# Altium schematic sheet FPGA_IO_3_4_5.SchDoc
size Tabloid; SheetNumber: 7; SheetTotal: 7; Sheet_Name: FPGA IO BANKS 3, 4 & 5; Size: 11x17
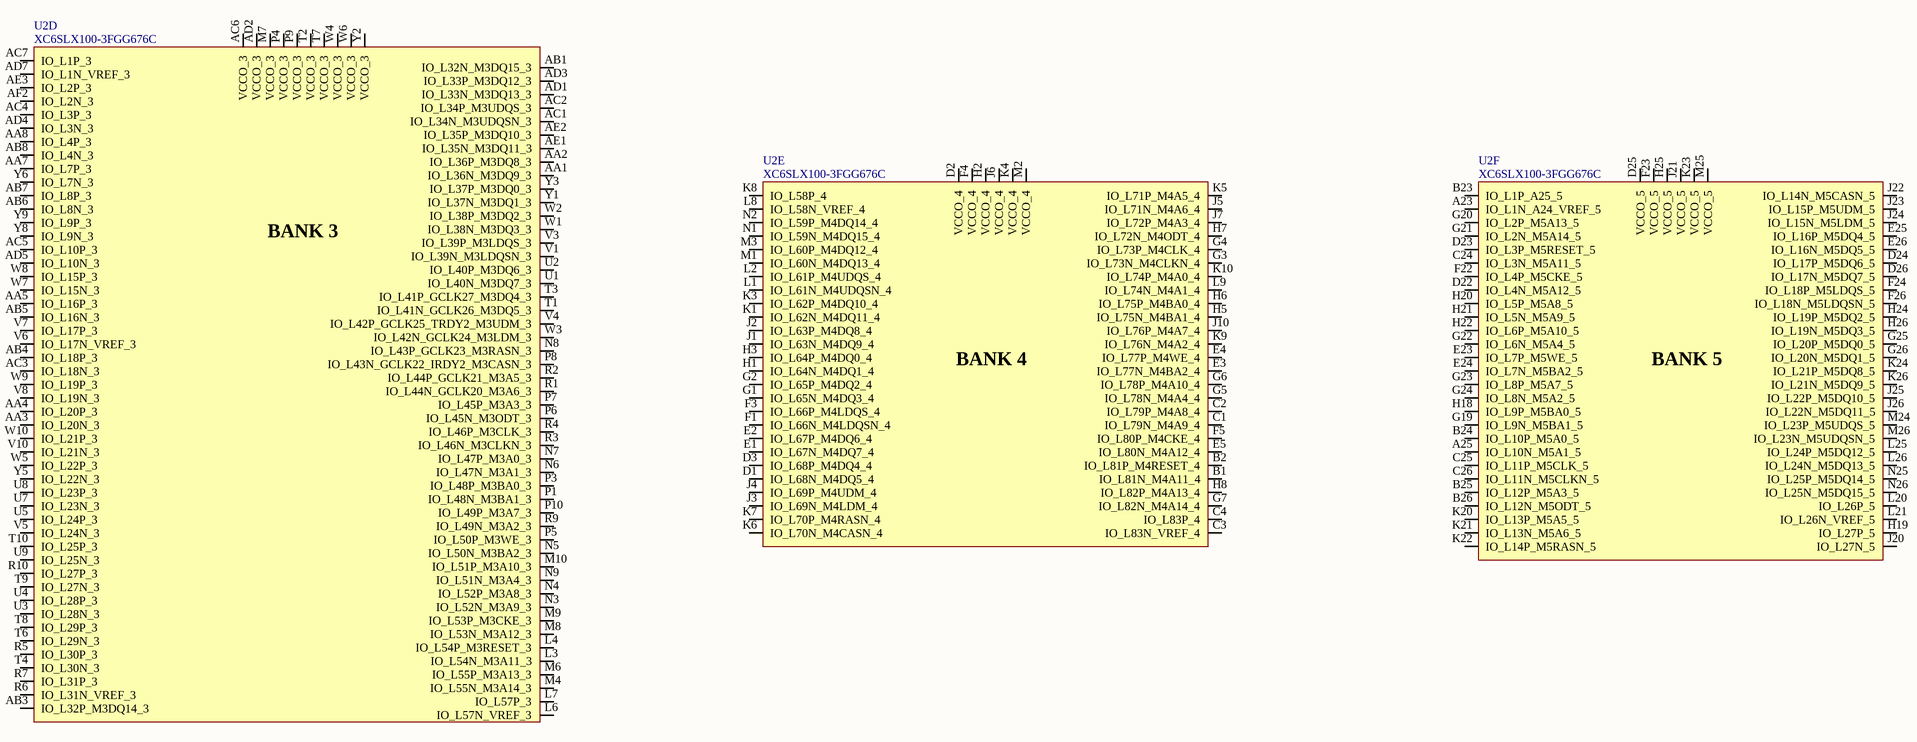
[diagram p0: FPGA_IO_3_4_5.SchDoc]

## Parts
U2  XC6SLX100-3FGG676C  [FPGA_XILINX_FGG676]  (parts D,E,F of 10)

## Nets

Not connected (* = marked no-connect by the designer): U2 A23(IO_L1N_A24_VREF_5) A25(IO_L10N_M5A1_5) AA1(IO_L36N_M3DQ9_3) AA2(IO_L36P_M3DQ8_3) AA3(IO_L20N_3) AA4(IO_L20P_3) AA5(IO_L16P_3) AA7(IO_L7P_3) AA8(IO_L4P_3) AB1(IO_L32N_M3DQ15_3) AB3(IO_L32P_M3DQ14_3) AB4(IO_L18P_3) AB5(IO_L16N_3) AB6(IO_L8N_3) AB7(IO_L8P_3) AB8(IO_L4N_3) AC1(IO_L34N_M3UDQSN_3) AC2(IO_L34P_M3UDQS_3) AC3(IO_L18N_3) AC4(IO_L3P_3) AC5(IO_L10P_3) AC6(VCCO_3) AC7(IO_L1P_3) AD1(IO_L33N_M3DQ13_3) AD2(VCCO_3) AD3(IO_L33P_M3DQ12_3) AD4(IO_L3N_3) AD5(IO_L10N_3) AD7(IO_L1N_VREF_3) AE1(IO_L35N_M3DQ11_3) AE2(IO_L35P_M3DQ10_3) AE3(IO_L2P_3) AF2(IO_L2N_3) B1(IO_L81N_M4A11_4) B2(IO_L81P_M4RESET_4) B23(IO_L1P_A25_5) B24(IO_L10P_M5A0_5) B25(IO_L12P_M5A3_5) B26(IO_L12N_M5ODT_5) C1(IO_L79N_M4A9_4) C2(IO_L79P_M4A8_4) C3(IO_L83N_VREF_4) C4(IO_L83P_4) C24(IO_L3N_M5A11_5) C25(IO_L11P_M5CLK_5) C26(IO_L11N_M5CLKN_5) D1(IO_L68N_M4DQ5_4) D2(VCCO_4) D3(IO_L68P_M4DQ4_4) D22(IO_L4N_M5A12_5) D23(IO_L3P_M5RESET_5) D24(IO_L17P_M5DQ6_5) D25(VCCO_5) D26(IO_L17N_M5DQ7_5) E1(IO_L67N_M4DQ7_4) E2(IO_L67P_M4DQ6_4) E3(IO_L77N_M4BA2_4) E4(IO_L77P_M4WE_4) E5(IO_L80N_M4A12_4) E23(IO_L7P_M5WE_5) E24(IO_L7N_M5BA2_5) E25(IO_L16P_M5DQ4_5) E26(IO_L16N_M5DQ5_5) F1(IO_L66N_M4LDQSN_4) F3(IO_L66P_M4LDQS_4) F4(VCCO_4) F5(IO_L80P_M4CKE_4) F22(IO_L4P_M5CKE_5) F23(VCCO_5) F24(IO_L18P_M5LDQS_5) F26(IO_L18N_M5LDQSN_5) G1(IO_L65N_M4DQ3_4) G2(IO_L65P_M4DQ2_4) G3(IO_L73N_M4CLKN_4) G4(IO_L73P_M4CLK_4) G5(IO_L78N_M4A4_4) G6(IO_L78P_M4A10_4) G7(IO_L82N_M4A14_4) G19(IO_L9N_M5BA1_5) G20(IO_L2P_M5A13_5) G21(IO_L2N_M5A14_5) G22(IO_L6N_M5A4_5) G23(IO_L8P_M5A7_5) G24(IO_L8N_M5A2_5) G25(IO_L20P_M5DQ0_5) G26(IO_L20N_M5DQ1_5) H1(IO_L64N_M4DQ1_4) H2(VCCO_4) H3(IO_L64P_M4DQ0_4) H5(IO_L75N_M4BA1_4) H6(IO_L75P_M4BA0_4) H7(IO_L72N_M4ODT_4) H8(IO_L82P_M4A13_4) H18(IO_L9P_M5BA0_5) H19(IO_L27P_5) H20(IO_L5P_M5A8_5) H21(IO_L5N_M5A9_5) H22(IO_L6P_M5A10_5) H24(IO_L19P_M5DQ2_5) H25(VCCO_5) H26(IO_L19N_M5DQ3_5) J1(IO_L63N_M4DQ9_4) J2(IO_L63P_M4DQ8_4) J3(IO_L69N_M4LDM_4) J4(IO_L69P_M4UDM_4) J5(IO_L71N_M4A6_4) J6(VCCO_4) J7(IO_L72P_M4A3_4) J10(IO_L76P_M4A7_4) J20(IO_L27N_5) J21(VCCO_5) J22(IO_L14N_M5CASN_5) J23(IO_L15P_M5UDM_5) J24(IO_L15N_M5LDM_5) J25(IO_L22P_M5DQ10_5) J26(IO_L22N_M5DQ11_5) K1(IO_L62N_M4DQ11_4) K3(IO_L62P_M4DQ10_4) K4(VCCO_4) K5(IO_L71P_M4A5_4) K6(IO_L70N_M4CASN_4) K7(IO_L70P_M4RASN_4) K8(IO_L58P_4) K9(IO_L76N_M4A2_4) K10(IO_L74P_M4A0_4) K20(IO_L13P_M5A5_5) K21(IO_L13N_M5A6_5) K22(IO_L14P_M5RASN_5) K23(VCCO_5) K24(IO_L21P_M5DQ8_5) K26(IO_L21N_M5DQ9_5) L1(IO_L61N_M4UDQSN_4) L2(IO_L61P_M4UDQS_4) L3(IO_L54N_M3A11_3) L4(IO_L54P_M3RESET_3) L6(IO_L57N_VREF_3) L7(IO_L57P_3) L8(IO_L58N_VREF_4) L9(IO_L74N_M4A1_4) L20(IO_L26P_5) L21(IO_L26N_VREF_5) L25(IO_L24P_M5DQ12_5) L26(IO_L24N_M5DQ13_5) M1(IO_L60N_M4DQ13_4) M2(VCCO_4) M3(IO_L60P_M4DQ12_4) M4(IO_L55N_M3A14_3) M6(IO_L55P_M3A13_3) M7(VCCO_3) M8(IO_L53N_M3A12_3) M9(IO_L53P_M3CKE_3) M10(IO_L51P_M3A10_3) M24(IO_L23P_M5UDQS_5) M25(VCCO_5) M26(IO_L23N_M5UDQSN_5) N1(IO_L59N_M4DQ15_4) N2(IO_L59P_M4DQ14_4) N3(IO_L52N_M3A9_3) N4(IO_L52P_M3A8_3) N5(IO_L50N_M3BA2_3) N6(IO_L47N_M3A1_3) N7(IO_L47P_M3A0_3) N8(IO_L43P_GCLK23_M3RASN_3) N9(IO_L51N_M3A4_3) N25(IO_L25P_M5DQ14_5) N26(IO_L25N_M5DQ15_5) P1(IO_L48N_M3BA1_3) P3(IO_L48P_M3BA0_3) P4(VCCO_3) P5(IO_L50P_M3WE_3) P6(IO_L45N_M3ODT_3) P7(IO_L45P_M3A3_3) P8(IO_L43N_GCLK22_IRDY2_M3CASN_3) P9(VCCO_3) P10(IO_L49P_M3A7_3) R1(IO_L44N_GCLK20_M3A6_3) R2(IO_L44P_GCLK21_M3A5_3) R3(IO_L46N_M3CLKN_3) R4(IO_L46P_M3CLK_3) R5(IO_L30P_3) R6(IO_L31N_VREF_3) R7(IO_L31P_3) R9(IO_L49N_M3A2_3) R10(IO_L27P_3) T1(IO_L41N_GCLK26_M3DQ5_3) T2(VCCO_3) T3(IO_L41P_GCLK27_M3DQ4_3) T4(IO_L30N_3) T6(IO_L29N_3) T7(VCCO_3) T8(IO_L29P_3) T9(IO_L27N_3) T10(IO_L25P_3) U1(IO_L40N_M3DQ7_3) U2(IO_L40P_M3DQ6_3) U3(IO_L28N_3) U4(IO_L28P_3) U5(IO_L24P_3) U7(IO_L23N_3) U8(IO_L23P_3) U9(IO_L25N_3) V1(IO_L39N_M3LDQSN_3) V3(IO_L39P_M3LDQS_3) V4(IO_L42P_GCLK25_TRDY2_M3UDM_3) V5(IO_L24N_3) V6(IO_L17N_VREF_3) V7(IO_L17P_3) V8(IO_L19N_3) V10(IO_L21N_3) W1(IO_L38N_M3DQ3_3) W2(IO_L38P_M3DQ2_3) W3(IO_L42N_GCLK24_M3LDM_3) W4(VCCO_3) W5(IO_L22P_3) W6(VCCO_3) W7(IO_L15N_3) W8(IO_L15P_3) W9(IO_L19P_3) W10(IO_L21P_3) Y1(IO_L37N_M3DQ1_3) Y2(VCCO_3) Y3(IO_L37P_M3DQ0_3) Y5(IO_L22N_3) Y6(IO_L7N_3) Y8(IO_L9N_3) Y9(IO_L9P_3)

## Notes on the sheet
- Sheet Name
- Project Title
- Global Project
- Size
- Group
- Revision
- Date
- Sheet
- of
- Filename
- Designers
- (in symbol FPGA_XC6SLX100-3FGG676C, part D) BANK 3
- (in symbol FPGA_XC6SLX100-3FGG676C, part E) BANK 4
- (in symbol FPGA_XC6SLX100-3FGG676C, part F) BANK 5

## Library data of the parts
U2 = FPGA_XC6SLX100-3FGG676C: FPGA - XILINX SPARTAN 6 480 I/O - BGA-676; Voltage: 1.14 V ~ 1.26 V; Current: *; Power: *; Mfg: Xilinx; Mfg Part Number: XC6SLX100-3FGG676C; HelpURL: https://www.xilinx.com/support/documentation/data_sheets/ds162.pdf; CreatedBy: Jonathan Bouchard; Temperature: 0°C ~ 85°C (TJ); Value: *; Precision: *; Package: BGA-676; Supplier 1: Digikey; Supplier Part Number 1: 122-1760-ND